# Altium schematic sheet Э1.SchDoc: =title_line_1 + title_line_2
size 420 x 297 mm; SheetNumber: 3; SheetTotal: 3
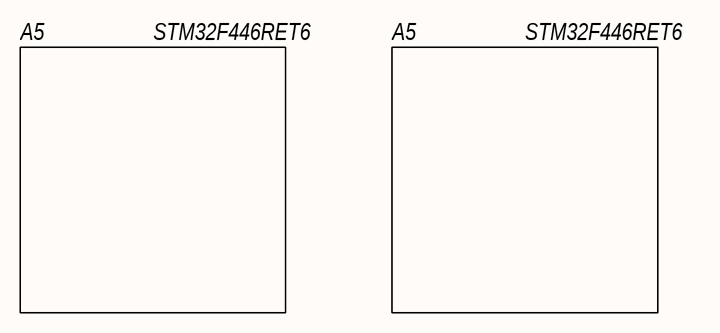
[diagram p0: Э1.SchDoc]

## Notes on the sheet
- A5
- STM32F446RET6
- Перв. примен.
- Справ. №
- Подп. и дата
- Инв. № дубл.
- Нормоконтроль:
- Взам. инв. №
- Изм.
- Лист
- № докум.
- Подп.
- Дата
- Лит.
- Масса
- Масштаб
- Т.контр.
- Пров.
- Разраб.
- Листов
- Разработал:
- Инв. № подл.
- Н.контр.
- Утв.
- Копировал
- Формат
- А3